# EAGLE design vn210-breakout (EAGLE 6.2)
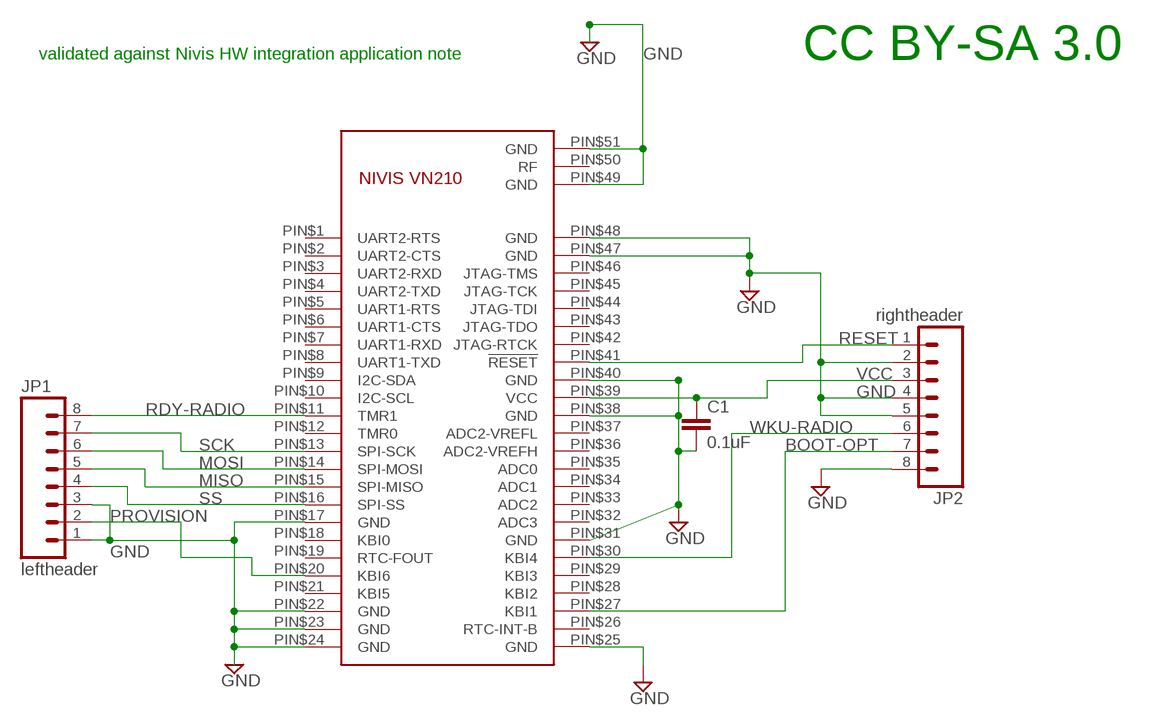
[diagram p0: schematic, sheet 1]

## Parts
C1  0.1uF  C-EUC1206  [C1206]
JP1  leftheader  M081X08  [1X08]
JP2  rightheader  M081X08  [1X08]
U$1  VN210  [VN210]

## Nets
BOOT-OPT: JP2.7 U$1.PIN$27(KBI1)
GND: C1.2 JP1.1 JP1.3 JP2.2 JP2.4 JP2.5 JP2.8 U$1.PIN$17(GND) U$1.PIN$22(GND) U$1.PIN$23(GND) U$1.PIN$24(GND) U$1.PIN$25(GND) U$1.PIN$31(GND) U$1.PIN$38(GND) U$1.PIN$40(GND) U$1.PIN$47(GND) U$1.PIN$48(GND) U$1.PIN$49(GND) U$1.PIN$51(GND)
MISO: JP1.5 U$1.PIN$15(SPI-MISO)
MOSI: JP1.6 U$1.PIN$14(SPI-MOSI)
PROVISION: JP1.2 U$1.PIN$20(KBI6)
RDY-RADIO: JP1.8 U$1.PIN$11(TMR1)
RESET: JP2.1 U$1.PIN$41(!RESET)
SCK: JP1.7 U$1.PIN$13(SPI-SCK)
SS: JP1.4 U$1.PIN$16(SPI-SS)
VCC: C1.1 JP2.3 U$1.PIN$39(VCC)
WKU-RADIO: JP2.6 U$1.PIN$30(KBI4)
Unconnected: U$1.PIN$1(UART2-RTS) U$1.PIN$2(UART2-CTS) U$1.PIN$3(UART2-RXD) U$1.PIN$4(UART2-TXD) U$1.PIN$5(UART1-RTS) U$1.PIN$6(UART1-CTS) U$1.PIN$7(UART1-RXD) U$1.PIN$8(UART1-TXD) U$1.PIN$9(I2C-SDA) U$1.PIN$10(I2C-SCL) U$1.PIN$12(TMR0) U$1.PIN$18(KBI0) U$1.PIN$19(RTC-FOUT) U$1.PIN$21(KBI5) U$1.PIN$26(RTC-INT-B) U$1.PIN$28(KBI2) U$1.PIN$29(KBI3) U$1.PIN$32(ADC3) U$1.PIN$33(ADC2) U$1.PIN$34(ADC1) U$1.PIN$35(ADC0) U$1.PIN$36(ADC2-VREFH) U$1.PIN$37(ADC2-VREFL) U$1.PIN$42(JTAG-RTCK) U$1.PIN$43(JTAG-TDO) U$1.PIN$44(JTAG-TDI) U$1.PIN$45(JTAG-TCK) U$1.PIN$46(JTAG-TMS) U$1.PIN$50(RF)

## Notes on the sheet
- validated against Nivis HW integration application note | CC BY-SA 3.0

## Library data of the parts
C1 = resistor:C-EU: CAPACITOR, European symbol
JP1 JP2 = SparkFun:M08: Header 8 Standard 8-pin 0.1" header. Use with straight break away headers (SKU : PRT-00116), right angle break away headers (PRT-00553), swiss pins (PRT-00743), machine pins (PRT-00117), and female headers (PRT-00115).
U$1 = nivis-vn210:VN210: Nivis VN210 VersaNode 802.15.4 Radio

## Board
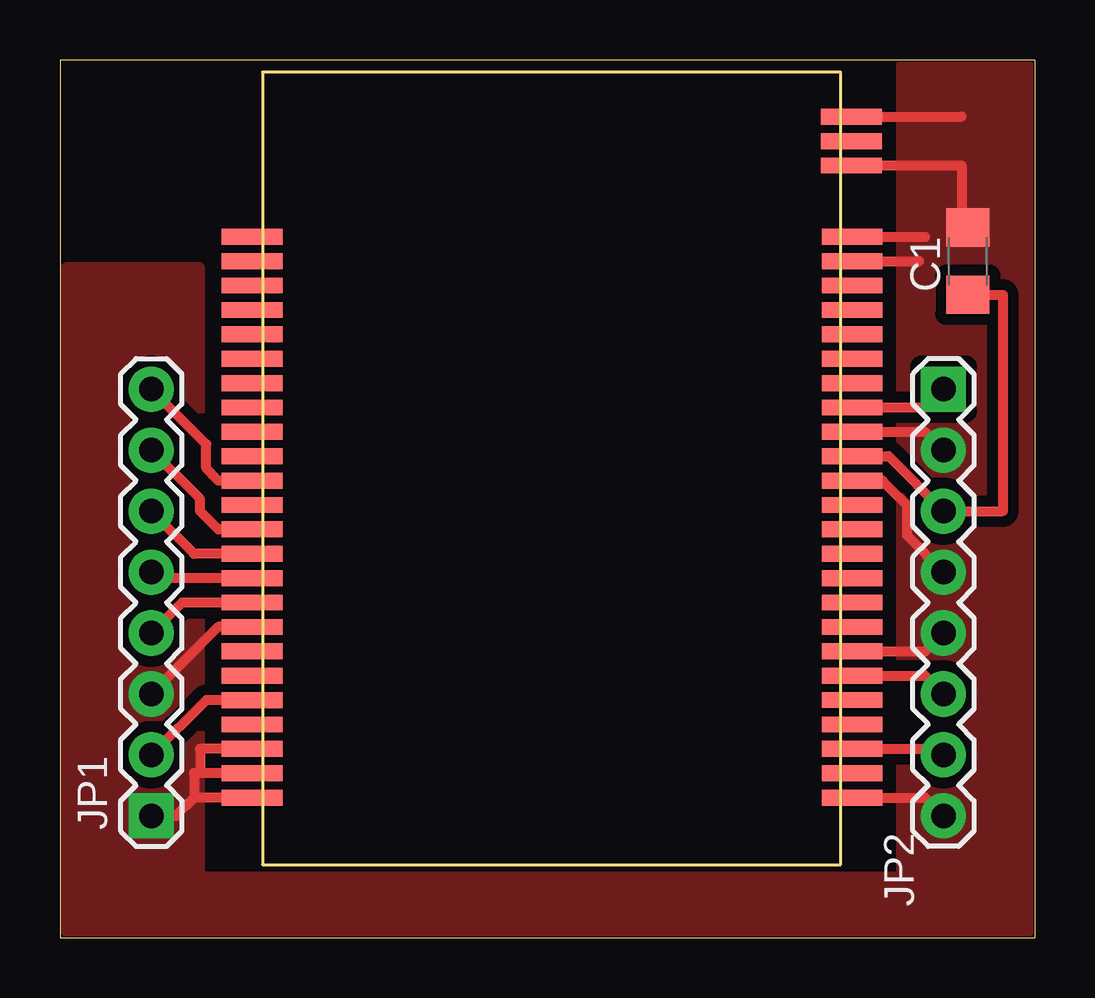
[diagram p1: board, top side]

Size 40.64 x 36.58 mm. Coordinates in mm from the lower left corner, seen from the top.
Outline: 0,0 40.64,0 40.64,36.58 0,36.57 0,0
Copper layers (1*16): Top 0.035mm / dielectric 1.5mm / Bottom 0.035mm
Design rules: minimum track width 10mil, minimum drill 24mil, track to track 18mil, track to pad 18mil, pad to pad 10mil, via to via 18mil, smd to smd 12mil, copper to edge 2mil, drill to drill 8mil, minimum pad ring 10mil, minimum via ring 8mil, stop-mask expansion 4mil, vias tented up to drill 0mil, thermal gap 10mil

### Footprints (pad centres in the part's own frame; a part is rotated, then mirrored left to right if it is on the bottom)
C1206 = smd 1.6 x 1.8: 1 -1.4,0; 2 1.4,0
1X08 = drill 1.016 pad 1.88 square: 1 0,0 | drill 1.016 pad 1.88: 2 2.54,0; 3 5.08,0; 4 7.62,0; 5 10.16,0; 6 12.7,0; 7 15.24,0; 8 17.78,0
VN210 = smd 2.54 x 0.66: PIN$1 -0.635,23.368; PIN$2 -0.635,22.352; PIN$3 -0.635,21.336; PIN$4 -0.635,20.32; PIN$5 -0.635,19.304; PIN$6 -0.635,18.288; PIN$7 -0.635,17.272; PIN$8 -0.635,16.256; PIN$9 -0.635,15.24; PIN$10 -0.635,14.224; PIN$11 -0.635,13.208; PIN$12 -0.635,12.192; PIN$13 -0.635,11.176; PIN$14 -0.635,10.16; PIN$15 -0.635,9.144; PIN$16 -0.635,8.128; PIN$17 -0.635,7.112; PIN$18 -0.635,6.096; PIN$19 -0.635,5.08; PIN$20 -0.635,4.064; PIN$21 -0.635,3.048; PIN$22 -0.635,2.032; PIN$23 -0.635,1.016; PIN$24 -0.635,0; PIN$25 24.384,0; PIN$26 24.384,1.016; PIN$27 24.384,2.032; PIN$28 24.384,3.048; PIN$30 24.384,5.08; PIN$31 24.384,6.096; PIN$32 24.384,7.112; PIN$33 24.384,8.128; PIN$34 24.384,9.144; PIN$35 24.384,10.16; PIN$36 24.384,11.176; PIN$37 24.384,12.192; PIN$38 24.384,13.208; PIN$39 24.384,14.224; PIN$40 24.384,15.24; PIN$41 24.384,16.256; PIN$42 24.384,17.272; PIN$43 24.384,18.288; PIN$44 24.384,19.304; PIN$45 24.384,20.32; PIN$46 24.384,21.336; PIN$47 24.384,22.352; PIN$48 24.384,23.368; PIN$49 24.359,26.34; PIN$50 24.359,27.356; PIN$51 24.359,28.372 | smd 2.54 x 0.635: PIN$29 24.384,4.064

### Placement (x,y rotation side)
C1  37.85,28.19 90 top
JP1  3.81,5.08 90 top
JP2  36.83,22.86 270 top
U$1  8.64,5.84 0 top

### Tracks (layer width: path | path; a pad name or v marks a point on that pad's centre or on a via)
BOOT-OPT
  Top 0.406: U$1.PIN$27 36.58,7.87 JP2.7
GND
  Top 0.406: 32.77,11.94 U$1.PIN$31 36.07,11.94 JP2.5 | U$1.PIN$24 5.59,5.84 | 5.59,5.84 4.83,5.08 | U$1.PIN$17 6.6,12.95 JP1.3 | U$1.PIN$23 5.84,6.86 | 5.84,6.86 5.59,6.86 5.59,5.84 | U$1.PIN$22 5.84,7.87 5.84,6.86 | U$1.PIN$51 37.59,34.21 | U$1.PIN$48 36.07,29.21 | U$1.PIN$49 37.59,32.18 37.59,29.72 | U$1.PIN$47 35.81,28.19 | U$1.PIN$40 36.07,21.08 JP2.2 | U$1.PIN$25 36.07,5.84 JP2.8 | U$1.PIN$38 34.29,19.05 35.31,18.03 35.31,16.76 JP2.4
  pour Top (no thermals): 0.25,27.94 0.25,0.25 40.39,0.25 40.39,36.32 35.05,36.32 35.05,2.54 5.84,2.54 5.84,27.94
MISO
  Top 0.406: U$1.PIN$15 4.06,14.99 JP1.5
MOSI
  Top 0.406: U$1.PIN$14 5.59,16 JP1.6
PROVISION
  Top 0.406: U$1.PIN$20 6.1,9.91 JP1.2
RDY-RADIO
  Top 0.406: U$1.PIN$11 6.6,19.05 6.1,19.56 6.1,20.57 JP1.8
RESET
  Top 0.406: U$1.PIN$41 36.07,22.1 JP2.1
SCK
  Top 0.406: U$1.PIN$13 6.6,17.02 5.84,17.78 5.84,18.29 JP1.7
SS
  Top 0.406: U$1.PIN$16 5.08,13.97 JP1.4
VCC
  Top 0.406: C1.1 39.31,26.79 39.31,17.78 JP2.3 34.54,20.07 U$1.PIN$39
WKU-RADIO
  Top 0.406: U$1.PIN$30 36.07,10.92 JP2.6